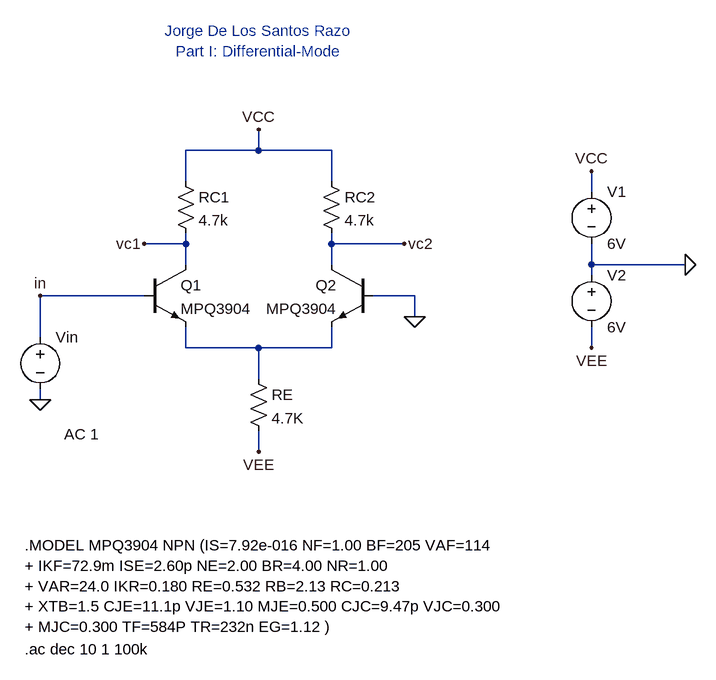
[diagram p0: schematic Differential-Mode.asc]
Differential-Mode.asc, the LTspice schematic file:
Version 4.1
SHEET 1 916 768
WIRE 192 -16 192 -48
WIRE 192 -16 80 -16
WIRE 304 -16 192 -16
WIRE 80 32 80 -16
WIRE 304 32 304 -16
WIRE 704 48 704 16
WIRE 80 128 80 112
WIRE 80 128 16 128
WIRE 304 128 304 112
WIRE 416 128 304 128
WIRE 80 160 80 128
WIRE 304 160 304 128
WIRE 704 160 704 128
WIRE 848 160 704 160
WIRE 704 176 704 160
WIRE 16 208 -144 208
WIRE 432 208 368 208
WIRE 432 240 432 208
WIRE -144 272 -144 208
WIRE 80 288 80 256
WIRE 192 288 80 288
WIRE 304 288 304 256
WIRE 304 288 192 288
WIRE 704 288 704 256
WIRE 192 336 192 288
WIRE -144 368 -144 352
WIRE 192 448 192 416
FLAG -144 368 0
FLAG 192 448 VEE
FLAG 192 -48 VCC
FLAG 432 240 0
FLAG 704 288 VEE
FLAG 704 16 VCC
FLAG 848 160 0
FLAG 16 128 vc1
FLAG -144 208 in
FLAG 416 128 vc2
SYMBOL npn 368 160 M0
SYMATTR InstName Q2
SYMATTR Value MPQ3904
SYMBOL npn 16 160 R0
SYMATTR InstName Q1
SYMATTR Value MPQ3904
SYMBOL res 64 16 R0
SYMATTR InstName RC1
SYMATTR Value 4.7k
SYMBOL res 288 16 R0
SYMATTR InstName RC2
SYMATTR Value 4.7k
SYMBOL res 176 320 R0
SYMATTR InstName RE
SYMATTR Value 4.7K
SYMBOL voltage -144 256 R0
WINDOW 3 37 137 Left 2
WINDOW 123 37 165 Left 2
WINDOW 39 0 0 Left 0
SYMATTR InstName Vin
SYMATTR Value ""
SYMATTR Value2 AC 1
SYMBOL voltage 704 32 R0
SYMATTR InstName V1
SYMATTR Value 6V
SYMBOL voltage 704 160 R0
SYMATTR InstName V2
SYMATTR Value 6V
TEXT -168 592 Left 2 !.MODEL MPQ3904 NPN (IS=7.92e-016 NF=1.00 BF=205 VAF=114\n+ IKF=72.9m ISE=2.60p NE=2.00 BR=4.00 NR=1.00\n+ VAR=24.0 IKR=0.180 RE=0.532 RB=2.13 RC=0.213\n+ XTB=1.5 CJE=11.1p VJE=1.10 MJE=0.500 CJC=9.47p VJC=0.300\n+ MJC=0.300 TF=584P TR=232n EG=1.12 )
TEXT 192 -184 Center 2 ;Jorge De Los Santos Razo\nPart I: Differential-Mode
TEXT -168 752 Left 2 !.ac dec 10 1 100k

The netlist it stands for:
* Differential-Mode.asc
Q2 vc2 0 N001 0 MPQ3904
Q1 vc1 in N001 0 MPQ3904
RC1 VCC vc1 4.7k
RC2 VCC vc2 4.7k
RE N001 VEE 4.7K
Vin in 0 AC 1
V1 VCC 0 6V
V2 0 VEE 6V
.model NPN NPN
.model PNP PNP
.lib standard.bjt
.MODEL MPQ3904 NPN (IS=7.92e-016 NF=1.00 BF=205 VAF=114
+ IKF=72.9m ISE=2.60p NE=2.00 BR=4.00 NR=1.00
+ VAR=24.0 IKR=0.180 RE=0.532 RB=2.13 RC=0.213
+ XTB=1.5 CJE=11.1p VJE=1.10 MJE=0.500 CJC=9.47p VJC=0.300
+ MJC=0.300 TF=584P TR=232n EG=1.12 )
* Jorge De Los Santos Razo
* Part I: Differential-Mode
.ac dec 10 1 100k
.backanno
.end